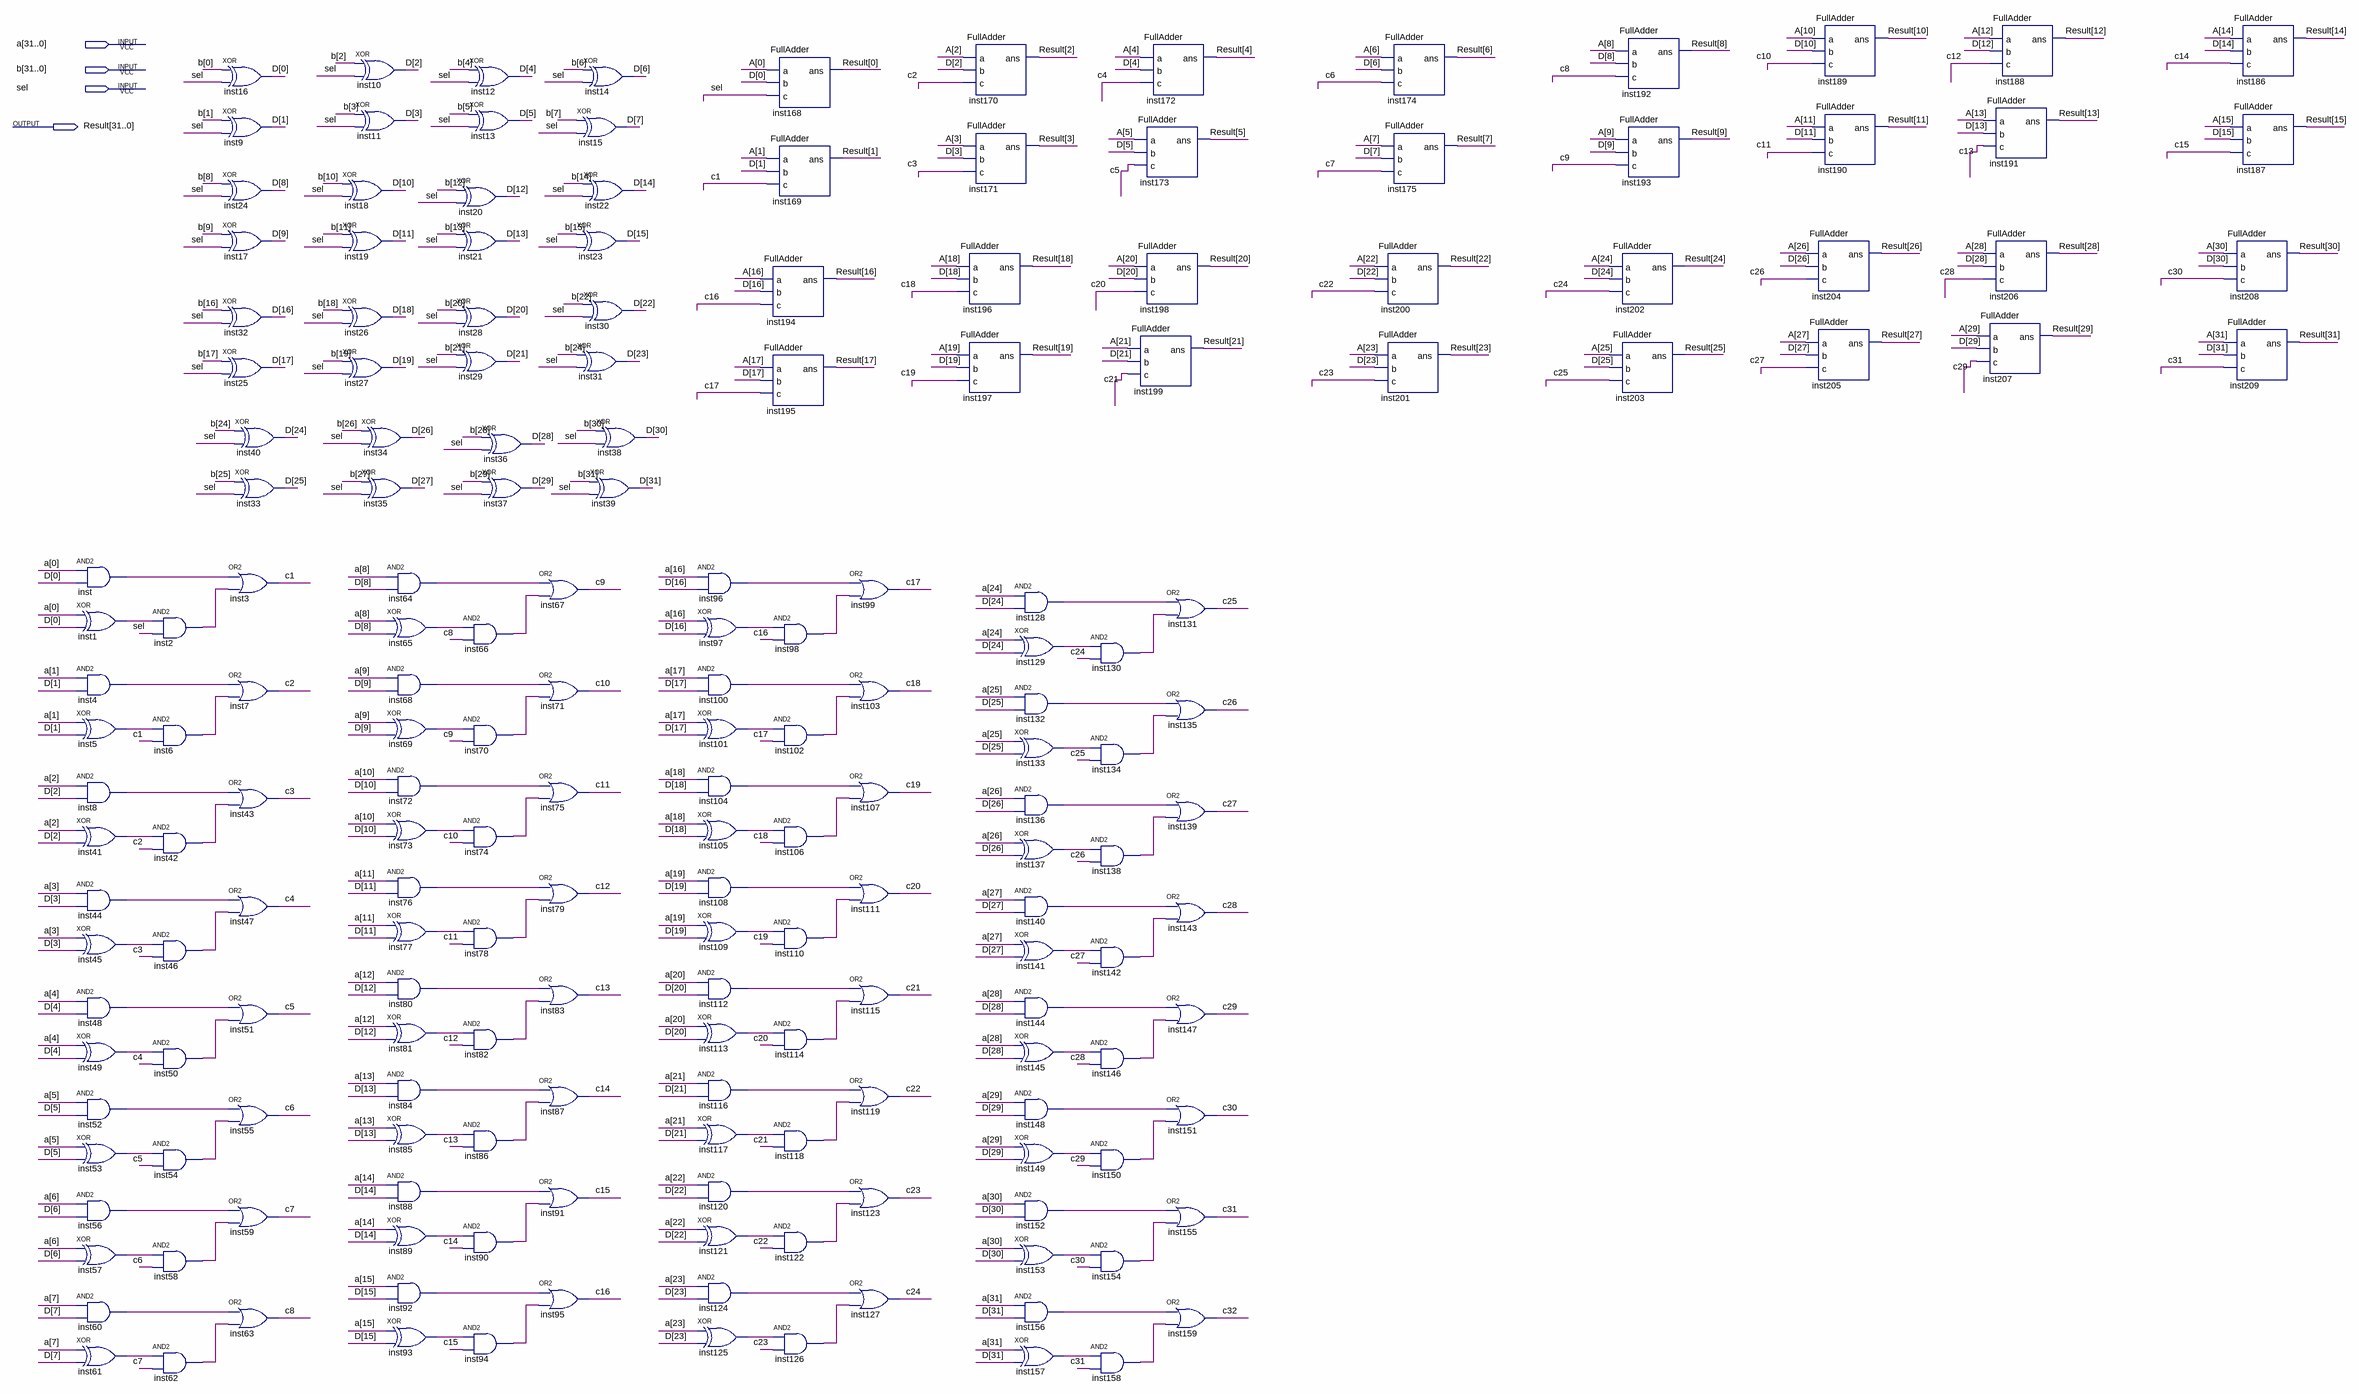
[diagram p0: schematic sheet]
// Quartus schematic CLA.bdf as structural Verilog: 192 symbols, 4 pins
module CLA (
  input  [31:0] a,
  input  [31:0] b,
  input  sel,
  output [31:0] Result
);

  wire c1, c2, c3, c4, c5, c6, c7, c8, c9, c10, c11, c12, c13, c14, c15, c16, c17, c18, c19, c20, c21, c22,
       c23, c24, c25, c26, c27, c28, c29, c30, c31, c32, inst1_out, inst2_out, inst4_out, inst5_out,
       inst6_out, inst8_out, inst41_out, inst42_out, inst44_out, inst45_out, inst46_out, inst48_out,
       inst49_out, inst50_out, inst52_out, inst53_out, inst54_out, inst56_out, inst57_out, inst58_out,
       inst60_out, inst61_out, inst62_out, inst64_out, inst65_out, inst66_out, inst68_out, inst69_out,
       inst70_out, inst72_out, inst73_out, inst74_out, inst76_out, inst77_out, inst78_out, inst80_out,
       inst81_out, inst82_out, inst84_out, inst85_out, inst86_out, inst88_out, inst89_out, inst90_out,
       inst92_out, inst93_out, inst94_out, inst96_out, inst97_out, inst98_out, inst100_out, inst101_out,
       inst102_out, inst104_out, inst105_out, inst106_out, inst108_out, inst109_out, inst110_out,
       inst112_out, inst113_out, inst114_out, inst116_out, inst117_out, inst118_out, inst120_out,
       inst121_out, inst122_out, inst124_out, inst125_out, inst126_out, inst128_out, inst129_out,
       inst130_out, inst132_out, inst133_out, inst134_out, inst136_out, inst137_out, inst138_out,
       inst140_out, inst141_out, inst142_out, inst144_out, inst145_out, inst146_out, inst148_out,
       inst149_out, inst150_out, inst152_out, inst153_out, inst154_out, inst156_out, inst157_out,
       inst158_out, inst_out;
  wire [31:0] D;

  and inst (inst_out, a[0], D[0]);
  xor inst1 (inst1_out, a[0], D[0]);
  and inst4 (inst4_out, a[1], D[1]);
  xor inst5 (inst5_out, a[1], D[1]);
  and inst8 (inst8_out, a[2], D[2]);
  xor inst41 (inst41_out, a[2], D[2]);
  and inst44 (inst44_out, a[3], D[3]);
  xor inst45 (inst45_out, a[3], D[3]);
  and inst48 (inst48_out, a[4], D[4]);
  xor inst49 (inst49_out, a[4], D[4]);
  and inst52 (inst52_out, a[5], D[5]);
  xor inst53 (inst53_out, a[5], D[5]);
  and inst56 (inst56_out, a[6], D[6]);
  xor inst57 (inst57_out, a[6], D[6]);
  and inst60 (inst60_out, a[7], D[7]);
  xor inst61 (inst61_out, a[7], D[7]);
  and inst2 (inst2_out, inst1_out, sel);
  and inst6 (inst6_out, inst5_out, c1);
  and inst42 (inst42_out, inst41_out, c2);
  and inst46 (inst46_out, inst45_out, c3);
  and inst50 (inst50_out, inst49_out, c4);
  and inst54 (inst54_out, inst53_out, c5);
  and inst58 (inst58_out, inst57_out, c6);
  and inst62 (inst62_out, inst61_out, c7);
  xor inst16 (D[0], b[0], sel);
  xor inst9 (D[1], b[1], sel);
  xor inst24 (D[8], b[8], sel);
  xor inst17 (D[9], b[9], sel);
  xor inst32 (D[16], b[16], sel);
  xor inst25 (D[17], b[17], sel);
  xor inst40 (D[24], b[24], sel);
  xor inst33 (D[25], b[25], sel);
  or inst3 (c1, inst_out, inst2_out);
  or inst7 (c2, inst4_out, inst6_out);
  or inst43 (c3, inst8_out, inst42_out);
  or inst47 (c4, inst44_out, inst46_out);
  or inst51 (c5, inst48_out, inst50_out);
  or inst55 (c6, inst52_out, inst54_out);
  or inst59 (c7, inst56_out, inst58_out);
  or inst63 (c8, inst60_out, inst62_out);
  xor inst18 (D[10], b[10], sel);
  xor inst19 (D[11], b[11], sel);
  xor inst26 (D[18], b[18], sel);
  xor inst27 (D[19], b[19], sel);
  xor inst10 (D[2], b[2], sel);
  xor inst11 (D[3], b[3], sel);
  xor inst34 (D[26], b[26], sel);
  xor inst35 (D[27], b[27], sel);
  and inst64 (inst64_out, a[8], D[8]);
  xor inst65 (inst65_out, a[8], D[8]);
  and inst68 (inst68_out, a[9], D[9]);
  xor inst69 (inst69_out, a[9], D[9]);
  and inst72 (inst72_out, a[10], D[10]);
  xor inst73 (inst73_out, a[10], D[10]);
  and inst76 (inst76_out, a[11], D[11]);
  xor inst77 (inst77_out, a[11], D[11]);
  and inst80 (inst80_out, a[12], D[12]);
  xor inst81 (inst81_out, a[12], D[12]);
  and inst84 (inst84_out, a[13], D[13]);
  xor inst85 (inst85_out, a[13], D[13]);
  and inst88 (inst88_out, a[14], D[14]);
  xor inst89 (inst89_out, a[14], D[14]);
  and inst92 (inst92_out, a[15], D[15]);
  xor inst93 (inst93_out, a[15], D[15]);
  xor inst12 (D[4], b[4], sel);
  xor inst13 (D[5], b[5], sel);
  xor inst20 (D[12], b[12], sel);
  xor inst21 (D[13], b[13], sel);
  xor inst28 (D[20], b[20], sel);
  xor inst29 (D[21], b[21], sel);
  xor inst36 (D[28], b[28], sel);
  xor inst37 (D[29], b[29], sel);
  and inst66 (inst66_out, inst65_out, c8);
  and inst70 (inst70_out, inst69_out, c9);
  and inst74 (inst74_out, inst73_out, c10);
  and inst78 (inst78_out, inst77_out, c11);
  and inst82 (inst82_out, inst81_out, c12);
  and inst86 (inst86_out, inst85_out, c13);
  and inst90 (inst90_out, inst89_out, c14);
  and inst94 (inst94_out, inst93_out, c15);
  or inst67 (c9, inst64_out, inst66_out);
  or inst71 (c10, inst68_out, inst70_out);
  or inst75 (c11, inst72_out, inst74_out);
  or inst79 (c12, inst76_out, inst78_out);
  or inst83 (c13, inst80_out, inst82_out);
  or inst87 (c14, inst84_out, inst86_out);
  or inst91 (c15, inst88_out, inst90_out);
  or inst95 (c16, inst92_out, inst94_out);
  xor inst14 (D[6], b[6], sel);
  xor inst15 (D[7], b[7], sel);
  xor inst22 (D[14], b[14], sel);
  xor inst23 (D[15], b[15], sel);
  xor inst30 (D[22], b[22], sel);
  xor inst31 (D[23], b[24], sel);
  xor inst38 (D[30], b[30], sel);
  xor inst39 (D[31], b[31], sel);
  and inst96 (inst96_out, a[16], D[16]);
  xor inst97 (inst97_out, a[16], D[16]);
  and inst100 (inst100_out, a[17], D[17]);
  xor inst101 (inst101_out, a[17], D[17]);
  and inst104 (inst104_out, a[18], D[18]);
  xor inst105 (inst105_out, a[18], D[18]);
  and inst108 (inst108_out, a[19], D[19]);
  xor inst109 (inst109_out, a[19], D[19]);
  and inst112 (inst112_out, a[20], D[20]);
  xor inst113 (inst113_out, a[20], D[20]);
  and inst116 (inst116_out, a[21], D[21]);
  xor inst117 (inst117_out, a[21], D[21]);
  and inst120 (inst120_out, a[22], D[22]);
  xor inst121 (inst121_out, a[22], D[22]);
  and inst124 (inst124_out, a[23], D[23]);
  xor inst125 (inst125_out, a[23], D[23]);
  FullAdder inst168 (.a(a[0]), .b(D[0]), .c(sel), .ans(Result[0]));
  FullAdder inst169 (.a(a[1]), .b(D[1]), .c(c1), .ans(Result[1]));
  FullAdder inst194 (.a(a[16]), .b(D[16]), .c(c16), .ans(Result[16]));
  FullAdder inst195 (.a(a[17]), .b(D[17]), .c(c17), .ans(Result[17]));
  and inst98 (inst98_out, inst97_out, c16);
  and inst102 (inst102_out, inst101_out, c17);
  and inst106 (inst106_out, inst105_out, c18);
  and inst110 (inst110_out, inst109_out, c19);
  and inst114 (inst114_out, inst113_out, c20);
  and inst118 (inst118_out, inst117_out, c21);
  and inst122 (inst122_out, inst121_out, c22);
  and inst126 (inst126_out, inst125_out, c23);
  or inst99 (c17, inst96_out, inst98_out);
  or inst103 (c18, inst100_out, inst102_out);
  or inst107 (c19, inst104_out, inst106_out);
  or inst111 (c20, inst108_out, inst110_out);
  or inst115 (c21, inst112_out, inst114_out);
  or inst119 (c22, inst116_out, inst118_out);
  or inst123 (c23, inst120_out, inst122_out);
  or inst127 (c24, inst124_out, inst126_out);
  FullAdder inst196 (.a(a[18]), .b(D[18]), .c(c18), .ans(Result[18]));
  FullAdder inst197 (.a(a[19]), .b(D[19]), .c(c19), .ans(Result[19]));
  FullAdder inst170 (.a(a[2]), .b(D[2]), .c(c2), .ans(Result[2]));
  FullAdder inst171 (.a(a[3]), .b(D[3]), .c(c3), .ans(Result[3]));
  and inst128 (inst128_out, a[24], D[24]);
  xor inst129 (inst129_out, a[24], D[24]);
  and inst132 (inst132_out, a[25], D[25]);
  xor inst133 (inst133_out, a[25], D[25]);
  and inst136 (inst136_out, a[26], D[26]);
  xor inst137 (inst137_out, a[26], D[26]);
  and inst140 (inst140_out, a[27], D[27]);
  xor inst141 (inst141_out, a[27], D[27]);
  and inst144 (inst144_out, a[28], D[28]);
  xor inst145 (inst145_out, a[28], D[28]);
  and inst148 (inst148_out, a[29], D[29]);
  xor inst149 (inst149_out, a[29], D[29]);
  and inst152 (inst152_out, a[30], D[30]);
  xor inst153 (inst153_out, a[30], D[30]);
  and inst156 (inst156_out, a[31], D[31]);
  xor inst157 (inst157_out, a[31], D[31]);
  and inst130 (inst130_out, inst129_out, c24);
  and inst134 (inst134_out, inst133_out, c25);
  and inst138 (inst138_out, inst137_out, c26);
  and inst142 (inst142_out, inst141_out, c27);
  and inst146 (inst146_out, inst145_out, c28);
  and inst150 (inst150_out, inst149_out, c29);
  and inst154 (inst154_out, inst153_out, c30);
  and inst158 (inst158_out, inst157_out, c31);
  FullAdder inst172 (.a(a[4]), .b(D[4]), .c(c4), .ans(Result[4]));
  FullAdder inst173 (.a(a[5]), .b(D[5]), .c(c5), .ans(Result[5]));
  FullAdder inst198 (.a(a[20]), .b(D[20]), .c(c20), .ans(Result[20]));
  FullAdder inst199 (.a(a[21]), .b(D[21]), .c(c21), .ans(Result[21]));
  or inst131 (c25, inst128_out, inst130_out);
  or inst135 (c26, inst132_out, inst134_out);
  or inst139 (c27, inst136_out, inst138_out);
  or inst143 (c28, inst140_out, inst142_out);
  or inst147 (c29, inst144_out, inst146_out);
  or inst151 (c30, inst148_out, inst150_out);
  or inst155 (c31, inst152_out, inst154_out);
  or inst159 (c32, inst156_out, inst158_out);
  FullAdder inst174 (.a(a[6]), .b(D[6]), .c(c6), .ans(Result[6]));
  FullAdder inst175 (.a(a[7]), .b(D[7]), .c(c7), .ans(Result[7]));
  FullAdder inst200 (.a(a[22]), .b(D[22]), .c(c22), .ans(Result[22]));
  FullAdder inst201 (.a(a[23]), .b(D[23]), .c(c23), .ans(Result[23]));
  FullAdder inst192 (.a(a[8]), .b(D[8]), .c(c8), .ans(Result[8]));
  FullAdder inst193 (.a(a[9]), .b(D[9]), .c(c9), .ans(Result[9]));
  FullAdder inst202 (.a(a[24]), .b(D[24]), .c(c24), .ans(Result[24]));
  FullAdder inst203 (.a(a[25]), .b(D[25]), .c(c25), .ans(Result[25]));
  FullAdder inst189 (.a(a[10]), .b(D[10]), .c(c10), .ans(Result[10]));
  FullAdder inst190 (.a(a[11]), .b(D[11]), .c(c11), .ans(Result[11]));
  FullAdder inst204 (.a(a[26]), .b(D[26]), .c(c26), .ans(Result[26]));
  FullAdder inst205 (.a(a[27]), .b(D[27]), .c(c27), .ans(Result[27]));
  FullAdder inst188 (.a(a[12]), .b(D[12]), .c(c12), .ans(Result[12]));
  FullAdder inst191 (.a(a[13]), .b(D[13]), .c(c13), .ans(Result[13]));
  FullAdder inst206 (.a(a[28]), .b(D[28]), .c(c28), .ans(Result[28]));
  FullAdder inst207 (.a(a[29]), .b(D[29]), .c(c29), .ans(Result[29]));
  FullAdder inst208 (.a(a[30]), .b(D[30]), .c(c30), .ans(Result[30]));
  FullAdder inst209 (.a(a[31]), .b(D[31]), .c(c31), .ans(Result[31]));
  FullAdder inst186 (.a(a[14]), .b(D[14]), .c(c14), .ans(Result[14]));
  FullAdder inst187 (.a(a[15]), .b(D[15]), .c(c15), .ans(Result[15]));
endmodule
